# EAGLE design gimbaldriver (EAGLE 7.1.0)
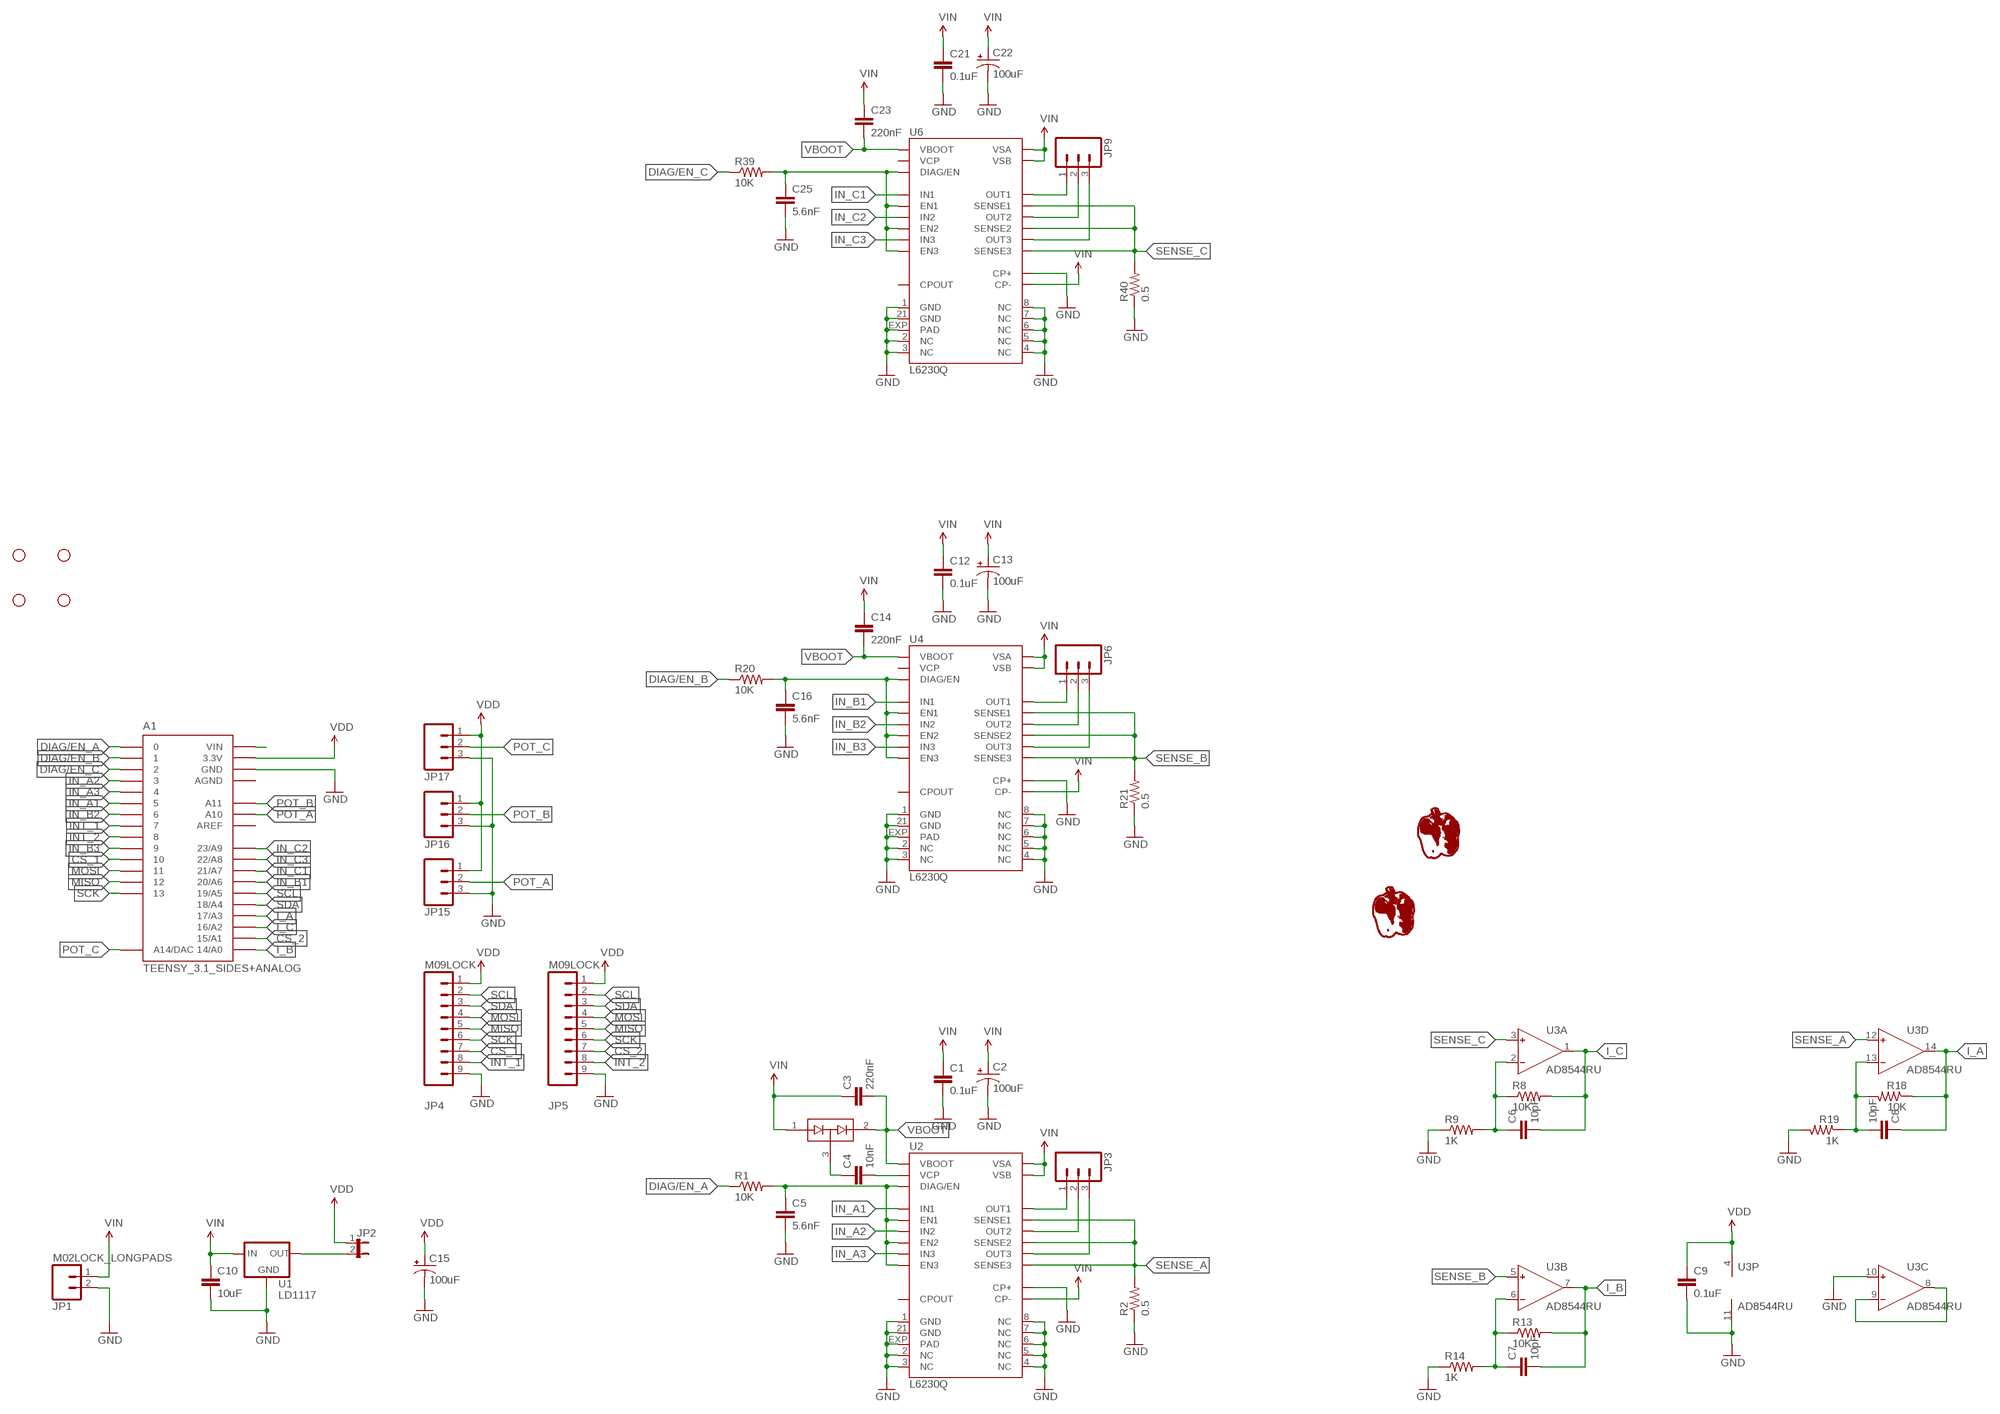
[diagram p0: schematic, sheet 1]

## Parts
A1  TEENSY_3.1_SIDES+ANALOG  [TEENSY_3.1_SIDES+ANALOG]
C1  0.1uF  CAP0603-CAP  [0603-CAP]
C2  100uF  CAP_POLPTH1  [CPOL-RADIAL-100UF-25V]
C3  220nF  CAP0603-CAP  [0603-CAP]
C4  10nF  CAP0603-CAP  [0603-CAP]
C5  5.6nF  CAP0603-CAP  [0603-CAP]
C6  10pF  CAP0603-CAP  [0603-CAP]
C7  10pF  CAP0603-CAP  [0603-CAP]
C8  10pF  CAP0603-CAP  [0603-CAP]
C9  0.1uF  CAP0603-CAP  [0603-CAP]
C10  10uF  CAP1206  [1206]
C12  0.1uF  CAP0603-CAP  [0603-CAP]
C13  100uF  CAP_POLPTH1  [CPOL-RADIAL-100UF-25V]
C14  220nF  CAP0603-CAP  [0603-CAP]
C15  100uF  CAP_POLPTH1  [CPOL-RADIAL-100UF-25V]
C16  5.6nF  CAP0603-CAP  [0603-CAP]
C21  0.1uF  CAP0603-CAP  [0603-CAP]
C22  100uF  CAP_POLPTH1  [CPOL-RADIAL-100UF-25V]
C23  220nF  CAP0603-CAP  [0603-CAP]
C25  5.6nF  CAP0603-CAP  [0603-CAP]
D1  BAV99  [SOT23]
JP1  M02LOCK_LONGPADS  [1X02_LOCK_LONGPADS]
JP2  JUMPER-2PTH_LOCK  [1X02_LOCK]
JP3  M03LOCK_LONGPADS  [1X03_LOCK_LONGPADS]
JP4  M09LOCK  [1X09_LOCK]
JP5  M09LOCK  [1X09_LOCK]
JP6  M03LOCK_LONGPADS  [1X03_LOCK_LONGPADS]
JP9  M03LOCK_LONGPADS  [1X03_LOCK_LONGPADS]
JP15  M03LOCK  [1X03_LOCK]
JP16  M03LOCK  [1X03_LOCK]
JP17  M03LOCK  [1X03_LOCK]
R1  10K  RESISTOR0603-RES  [0603-RES]
R2  0.5  RESISTOR1206  [1206]
R8  10K  RESISTOR0603-RES  [0603-RES]
R9  1K  RESISTOR0603-RES  [0603-RES]
R13  10K  RESISTOR0603-RES  [0603-RES]
R14  1K  RESISTOR0603-RES  [0603-RES]
R18  10K  RESISTOR0603-RES  [0603-RES]
R19  1K  RESISTOR0603-RES  [0603-RES]
R20  10K  RESISTOR0603-RES  [0603-RES]
R21  0.5  RESISTOR1206  [1206]
R39  10K  RESISTOR0603-RES  [0603-RES]
R40  0.5  RESISTOR1206  [1206]
STANDOFF1  STAND-OFF  [STAND-OFF]
STANDOFF2  STAND-OFF  [STAND-OFF]
STANDOFF3  STAND-OFF  [STAND-OFF]
STANDOFF4  STAND-OFF  [STAND-OFF]
U1  LD1117  [SOT-223]
U2  L6230Q  [VFQFPN-32]
U3  AD8544RU  [TSSOP14]
U4  L6230Q  [VFQFPN-32]
U6  L6230Q  [VFQFPN-32]
U$1  GIMP-PEPPER  [GIMP-PEPPER]
U$2  GIMBALV1  [GIMBALV1]

## Nets
CS_1: A1.10 JP4.7
CS_2: A1.15/A1 JP5.7
DIAG/EN_A: A1.0 R1.1
DIAG/EN_B: A1.1 R20.1
DIAG/EN_C: A1.2 R39.1
GND: A1.GND C1.2 C2.2(-) C5.2 C9.2 C10.2 C12.2 C13.2(-) C15.2(-) C16.2 C21.2 C22.2(-) C25.2 JP1.2 JP4.9 JP5.9 JP15.3 JP16.3 JP17.3 R2.1 R9.1 R14.1 R19.2 R21.1 R40.1 U1.1(GND) U2.1(GND) U2.2(NC) U2.3(NC) U2.4(NC) U2.5(NC) U2.6(NC) U2.7(NC) U2.8(NC) U2.21(GND) U2.30(CP+) U2.EXP(PAD) U3.10(C:IN+) U3.11(P:V-) U4.1(GND) U4.2(NC) U4.3(NC) U4.4(NC) U4.5(NC) U4.6(NC) U4.7(NC) U4.8(NC) U4.21(GND) U4.30(CP+) U4.EXP(PAD) U6.1(GND) U6.2(NC) U6.3(NC) U6.4(NC) U6.5(NC) U6.6(NC) U6.7(NC) U6.8(NC) U6.21(GND) U6.30(CP+) U6.EXP(PAD)
I_A: A1.17/A3 C8.1 R18.1 U3.14(D:OUT)
I_B: A1.14/A0 C7.2 R13.2 U3.7(B:OUT)
I_C: A1.16/A2 C6.2 R8.2 U3.1(A:OUT)
IN_A1: A1.5 U2.26(IN1)
IN_A2: A1.3 U2.13(IN2)
IN_A3: A1.4 U2.28(IN3)
IN_B1: A1.20/A6 U4.26(IN1)
IN_B2: A1.6 U4.13(IN2)
IN_B3: A1.9 U4.28(IN3)
IN_C1: A1.21/A7 U6.26(IN1)
IN_C2: A1.23/A9 U6.13(IN2)
IN_C3: A1.22/A8 U6.28(IN3)
INT_1: A1.7 JP4.8
INT_2: A1.8 JP5.8
MISO: A1.12 JP4.5 JP5.5
MOSI: A1.11 JP4.4 JP5.4
N$3: A1.VIN
N$6: C5.1 R1.2 U2.9(DIAG/EN) U2.14(EN2) U2.16(EN3) U2.27(EN1)
N$7: C6.1 R8.1 R9.2 U3.2(A:IN-)
N$8: JP3.1 U2.31(OUT1)
N$9: JP3.2 U2.23(OUT2)
N$10: JP3.3 U2.19(OUT3)
N$13: C7.1 R13.1 R14.2 U3.6(B:IN-)
N$19: C8.2 R18.2 R19.1 U3.13(D:IN-)
N$20: U3.8(C:OUT) U3.9(C:IN-)
N$25: C16.1 R20.2 U4.9(DIAG/EN) U4.14(EN2) U4.16(EN3) U4.27(EN1)
N$26: JP6.1 U4.31(OUT1)
N$27: JP6.2 U4.23(OUT2)
N$28: JP6.3 U4.19(OUT3)
N$32: C4.2 U2.24(VCP)
N$33: C25.1 R39.2 U6.9(DIAG/EN) U6.14(EN2) U6.16(EN3) U6.27(EN1)
N$34: C4.1 D1.3(COM)
N$46: JP9.1 U6.31(OUT1)
N$47: JP9.2 U6.23(OUT2)
N$48: JP9.3 U6.19(OUT3)
POT_A: A1.A10 JP15.2
POT_B: A1.A11 JP16.2
POT_C: A1.RST(A14/DAC) JP17.2
SCK: A1.13 JP4.6 JP5.6
SCL: A1.19/A5 JP4.2 JP5.2
SDA: A1.18/A4 JP4.3 JP5.3
SENSE_A: R2.2 U2.12(SENSE3) U2.25(SENSE2) U2.29(SENSE1) U3.12(D:IN+)
SENSE_B: R21.2 U3.5(B:IN+) U4.12(SENSE3) U4.25(SENSE2) U4.29(SENSE1)
SENSE_C: R40.2 U3.3(A:IN+) U6.12(SENSE3) U6.25(SENSE2) U6.29(SENSE1)
VBOOT: C3.2 C14.2 C23.2 D1.2(C2) U2.17(VBOOT) U4.17(VBOOT) U6.17(VBOOT)
VDD: A1.3.3V C9.1 C15.1(+) JP2.1 JP4.1 JP5.1 JP15.1 JP16.1 JP17.1 U3.4(P:V+)
VDDREG: JP2.2 U1.2(OUT) U1.4(OUT)
VIN: C1.1 C2.1(+) C3.1 C10.1 C12.1 C13.1(+) C14.1 C21.1 C22.1(+) C23.1 D1.1(A1) JP1.1 U1.3(IN) U2.15(CP-) U2.20(VSB) U2.22(VSA) U4.15(CP-) U4.20(VSB) U4.22(VSA) U6.15(CP-) U6.20(VSB) U6.22(VSA)
Unconnected: A1.AREF U2.11(CPOUT) U4.11(CPOUT) U4.24(VCP) U6.11(CPOUT) U6.24(VCP)

## Power pins joined to a net without a drawn wire
AGND: A1.AGND

## Library data of the parts
A1 = Teensy3.0:TEENSY_3.1_SIDES+ANALOG
C1 C3-C10 C12 C14 C16 C21 C23 C25 = SparkFun-Passives:CAP: Capacitor Standard 0603 ceramic capacitor, and 0.1" leaded capacitor.
C2 C13 C15 C22 = SparkFun-Passives:CAP_POL: Capacitor Polarized These are standard SMD and PTH capacitors. Normally 10uF, 47uF, and 100uF in electrolytic and tantalum varieties. Always verify the external diameter of the through hole cap, it varies with capacity, voltage, and manufacturer. The EIA devices should be standard.
D1 = SparkFun-DiscreteSemi:BAV99: Two small signal silicon diodes connected anode to cathode. Connections to all three nodes available. DIO-10647; PROD_ID: DIO-10647
JP1 = SparkFun-Connectors:M02: Standard 2-pin 0.1" header. Use with - straight break away headers ( PRT-00116) - right angle break away headers (PRT-00553) - swiss pins (PRT-00743) - machine pins (PRT-00117) - female headers (PRT-00115) Molex polarized connector foot print use with: PRT-08233 with associated crimp pins and housings. 2.54_SCREWTERM for use with PRT-10571. 3.5mm Screw Terminal footprints for PRT-08084 5mm Screw Terminal footprints for use with PRT-08432
JP2 = SparkFun-Retired:JUMPER-2: Jumper Basic 0.1" spaced jumper. Use with breakaway headers.
JP3 JP6 JP9 JP15-JP17 = SparkFun-Connectors:M03: Header 3 Standard 3-pin 0.1" header. Use with straight break away headers (SKU : PRT-00116), right angle break away headers (PRT-00553), swiss pins (PRT-00743), machine pins (PRT-00117), and female headers (PRT-00115). Molex polarized connector foot print use with SKU : PRT-08232 with associated crimp pins and housings.
JP4 JP5 = SparkFun-Connectors:M09: Header 9 Standard 9-pin 0.1" header. Use with straight break away headers (SKU : PRT-00116), right angle break away headers (PRT-00553), swiss pins (PRT-00743), machine pins (PRT-00117), and female headers (PRT-00115).
R1 R2 R8 R9 R13 R14 R18-R21 R39 R40 = SparkFun-Passives:RESISTOR: Resistor Basic schematic elements and footprints for 0603, 1206, and PTH resistors.
STANDOFF1-STANDOFF4 = SparkFun-Electromechanical:STAND-OFF: #4 Stand Off This is the mechanical footprint for a #4 phillips button head screw. Use the keepout ring to avoid running the screw head into surrounding components. SKU : PRT-00447
U1 = Custom:LD1117: Low-Dropout Voltage Regulator
U2 U4 U6 = Custom:L6230Q
U3 = analog-devices:AD8544: General-Purpose CMOS Rail-to-Rail Amplifiers Source: http://www.analog.com/static/imported-files/data_sheets/AD8541_8542_8544.pdf; MPN: AD8544ARUZ; OC_FARNELL: unknown; OC_NEWARK: 15P1001
U$1 = Custom:GIMP-PEPPER
U$2 = Custom:GIMBALV1

## Board
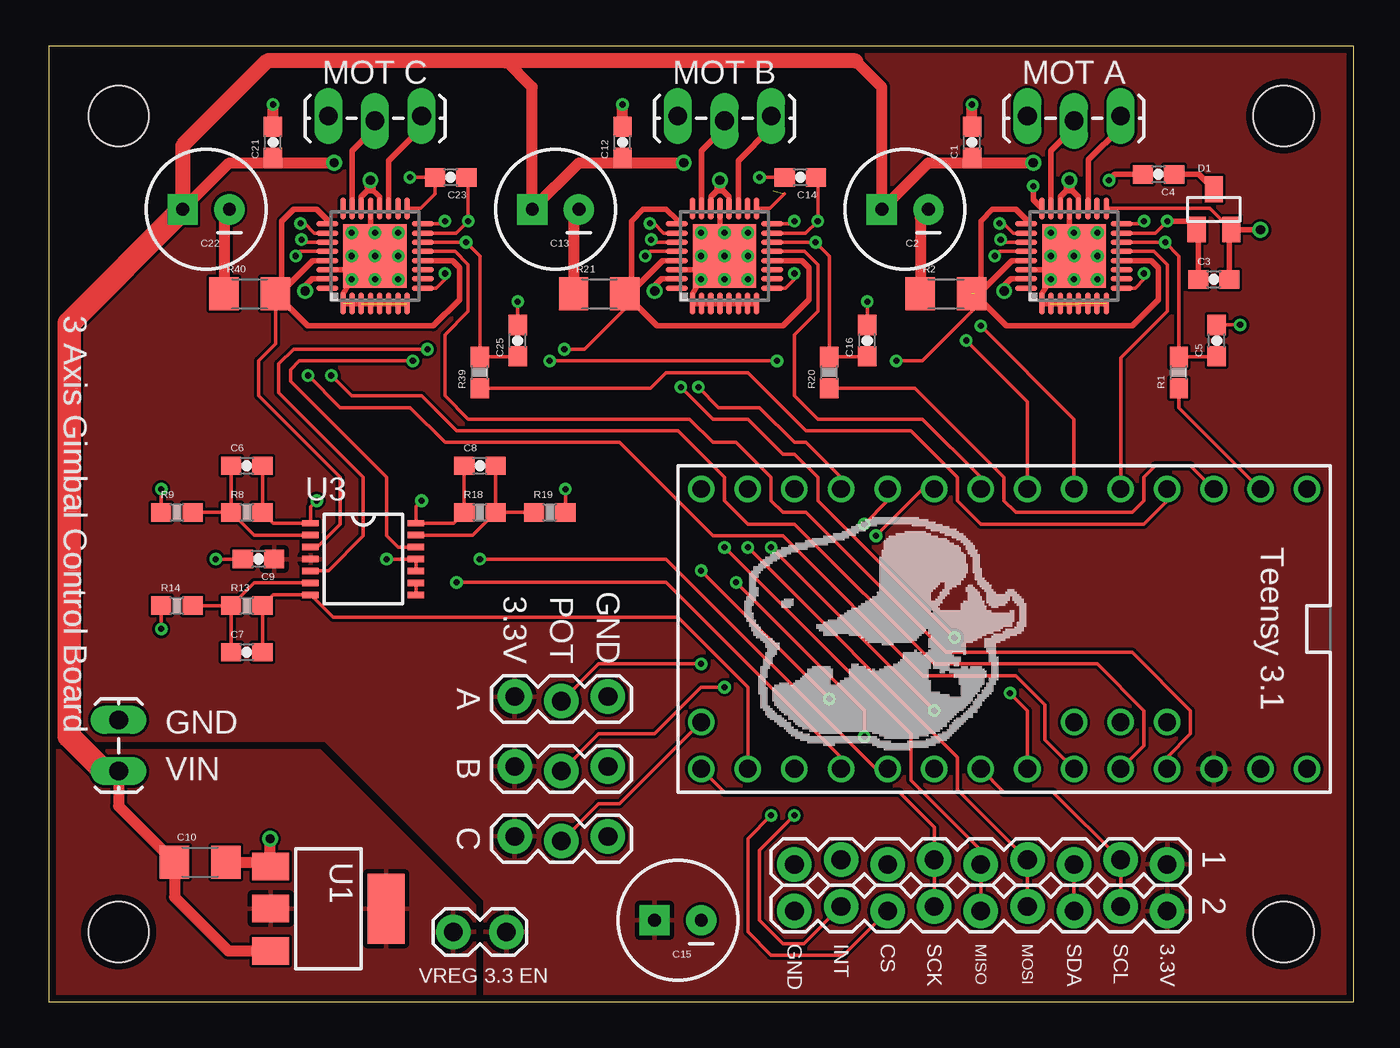
[diagram p1: board, top side]
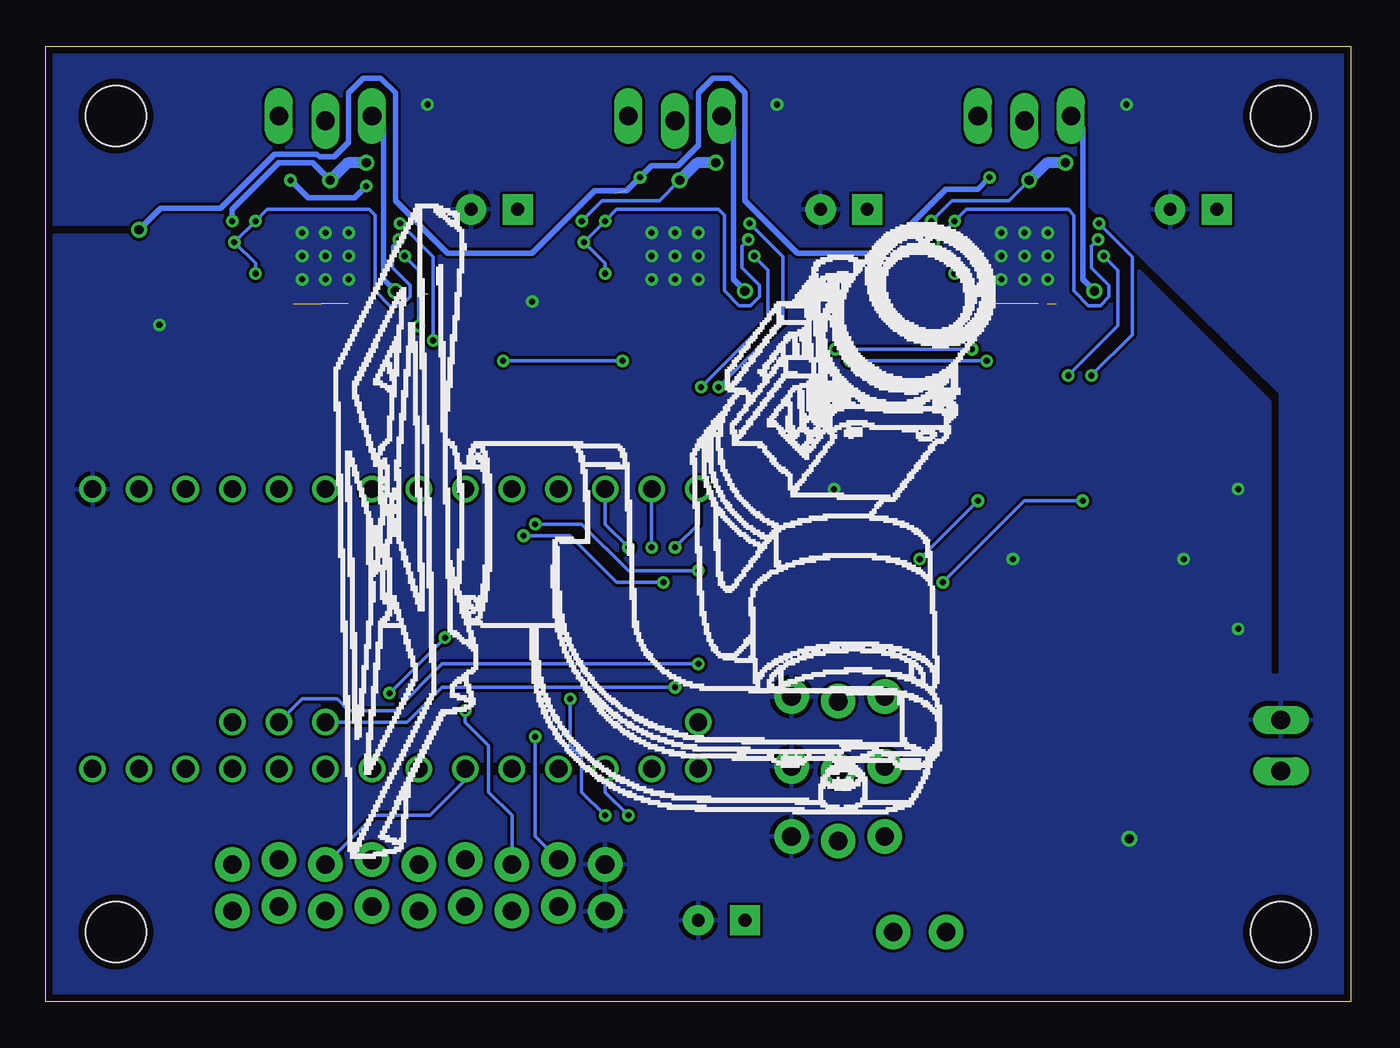
[diagram p2: board, bottom side, seen from below]

Size 71.12 x 52.07 mm. Coordinates in mm from the lower left corner, seen from the top.
Outline: 0,0 71.12,0 71.12,52.07 0,52.07 0,0
Copper layers (1*16): Top 0.0356mm / dielectric 1.5011mm / Bottom 0.0356mm
Design rules "LaenPCBOrder": minimum track width 6mil, minimum drill 13mil, track to track 6mil, track to pad 6mil, pad to pad 6mil, via to via 6mil, smd to smd 6mil, copper to edge 15mil, drill to drill 6mil, minimum pad ring 7mil, minimum via ring 7mil, stop-mask expansion 3mil, vias tented up to drill 0mil, thermal gap 10mil

### Footprints (pad centres in the part's own frame; a part is rotated, then mirrored left to right if it is on the bottom)
TEENSY_3.1_SIDES+ANALOG = drill 0.965: 0 -7.62,13.97; 1 -7.62,11.43; 2 -7.62,8.89; 3 -7.62,6.35; 3.3V 7.62,11.43; 4 -7.62,3.81; 5 -7.62,1.27; 6 -7.62,-1.27; 7 -7.62,-3.81; 8 -7.62,-6.35; 9 -7.62,-8.89; 10 -7.62,-11.43; 11 -7.62,-13.97; 12 -7.62,-16.51; 13 7.62,-16.51; 14/A0 7.62,-13.97; 15/A1 7.62,-11.43; 16/A2 7.62,-8.89; 17/A3 7.62,-6.35; 18/A4 7.62,-3.81; 19/A5 7.62,-1.27; 20/A6 7.62,1.27; 21/A7 7.62,3.81; 22/A8 7.62,6.35; 23/A9 7.62,8.89; A10 5.08,6.35; A11 5.08,3.81; AGND 7.62,13.97; AREF 5.08,8.89; GND -7.62,16.51; RST 5.08,-16.51; VIN 7.62,16.51
0603-CAP = smd 1.1 x 1: 1 -0.85,0; 2 0.85,0
CPOL-RADIAL-100UF-25V = drill 0.7 pad 1.651 square: 1 1.27,0 | drill 0.7 pad 1.651: 2 -1.27,0
1206 = smd 1.6 x 1.8: 1 -1.4,0; 2 1.4,0
SOT23 = smd 1 x 1.4: 1 -0.95,-1.1; 2 0.95,-1.1; 3 0,1.1
1X02_LOCK_LONGPADS = drill 1.016 long: 1 -0.127,0; 2 2.667,0
1X02_LOCK = drill 1.016 pad 1.88: 1 -0.178,0; 2 2.718,0
1X03_LOCK_LONGPADS = drill 1.016 long: 1 0,0; 2 2.54,-0.254; 3 5.08,0
1X09_LOCK = drill 1.016 pad 1.88: 1 0,0.127; 2 2.54,-0.127; 3 5.08,0.127; 4 7.62,-0.127; 5 10.16,0.127; 6 12.7,-0.127; 7 15.24,0.127; 8 17.78,-0.127; 9 20.32,0.127
1X03_LOCK = drill 1.016 pad 1.88: 1 0,0.127; 2 2.54,-0.127; 3 5.08,0.127
0603-RES = smd 1.1 x 1: 1 -0.85,0; 2 0.85,0
STAND-OFF = hole 3.302: 0,0
SOT-223 = smd 1.5 x 2: 1 -2.3,-3.15; 2 0,-3.15; 3 2.3,-3.15 | smd 3.8 x 2: 4 0,3.15
VFQFPN-32 = smd 1.2 x 0.3: 1 -2.6,1.75; 2 -2.6,1.25; 3 -2.6,0.75; 4 -2.6,0.25; 5 -2.6,-0.25; 6 -2.6,-0.75; 7 -2.6,-1.25; 8 -2.6,-1.75; 17 2.6,-1.75; 18 2.6,-1.25; 19 2.6,-0.75; 20 2.6,-0.25; 21 2.6,0.25; 22 2.6,0.75; 23 2.6,1.25; 24 2.6,1.75 | smd 0.3 x 1.2: 9 -1.75,-2.6; 10 -1.25,-2.6; 11 -0.75,-2.6; 12 -0.25,-2.6; 13 0.25,-2.6; 14 0.75,-2.6; 15 1.25,-2.6; 16 1.75,-2.6; 25 1.75,2.6; 26 1.25,2.6; 27 0.75,2.6; 28 0.25,2.6; 29 -0.25,2.6; 30 -0.75,2.6; 31 -1.25,2.6; 32 -1.75,2.6 | smd 3.45 x 3.45: EXP 0,0
TSSOP14 = smd 0.9 x 0.35: 1 -2.875,1.95; 2 -2.875,1.3; 3 -2.875,0.65; 4 -2.875,0; 5 -2.875,-0.65; 6 -2.875,-1.3; 7 -2.875,-1.95; 8 2.875,-1.95; 9 2.875,-1.3; 10 2.875,-0.65; 11 2.875,0; 12 2.875,0.65; 13 2.875,1.3; 14 2.875,1.95

### Placement (x,y rotation side)
A1  52.07,20.32 270 top
C1  50.32,46.83 90 top
C2  46.67,43.18 180 top
C3  63.5,39.37 0 top
C4  60.48,45.09 180 top
C5  63.66,36.04 90 top
C6  10.79,29.21 0 top
C7  10.79,19.05 0 top
C8  23.5,29.21 0 top
C9  11.43,24.13 180 top
C10  8.26,7.62 0 top
C12  31.27,46.83 90 top
C13  27.62,43.18 180 top
C14  40.96,44.93 180 top
C15  34.29,4.45 180 top
C16  44.61,36.04 90 top
C21  12.22,46.83 90 top
C22  8.57,43.18 180 top
C23  21.91,44.93 180 top
C25  25.56,36.04 90 top
D1  63.5,43.18 0 top
JP1  3.81,12.7 90 top
JP2  24.77,3.81 180 top
JP3  53.34,48.26 0 top
JP4  60.96,7.62 180 top
JP5  60.96,5.08 180 top
JP6  34.29,48.26 0 top
JP9  15.24,48.26 0 top
JP15  25.4,16.51 0 top
JP16  25.4,12.7 0 top
JP17  25.4,8.89 0 top
R1  61.59,34.29 90 top
R2  48.9,38.58 0 top
R8  10.79,26.67 0 top
R9  6.99,26.67 0 top
R13  10.79,21.59 0 top
R14  6.99,21.59 0 top
R18  23.5,26.67 0 top
R19  27.3,26.67 0 top
R20  42.55,34.29 90 top
R21  30,38.58 0 top
R39  23.5,34.29 90 top
R40  10.95,38.58 0 top
STANDOFF1  67.31,48.26 0 top
STANDOFF2  3.81,48.26 0 top
STANDOFF3  67.31,3.81 0 top
STANDOFF4  3.81,3.81 0 top
U1  15.24,5.08 270 top
U2  55.88,40.64 90 top
U3  17.14,24.13 0 top
U4  36.83,40.64 90 top
U6  17.78,40.64 90 top
U$1  45.09,20 270 top
U$2  36.83,25.4 90 bottom

### Tracks (layer width: path | path; a pad name or v marks a point on that pad's centre or on a via)
CS_1  (via drill 0.33)
  Top 0.203: v39.37,24.77 v48.26,15.88
  Bottom 0.203: A1.10 40.64,26.04 v39.37,24.77 | v48.26,15.88 48.26,15.24 46.99,13.97 46.99,11.43 45.72,10.16 JP4.7
CS_2  (via drill 0.33)
  Top 0.203: v39.37,10.16 38.1,8.89 38.1,3.81 39.37,2.54 43.31,2.54 JP5.7
  Bottom 0.203: A1.15/A1 40.64,11.43 v39.37,10.16
DIAG/EN_A
  Top 0.203: R1.1 61.59,32.38 A1.0
DIAG/EN_B
  Top 0.203: A1.1 62.23,29.21 60.33,29.21 59.69,28.57 59.69,27.3 59.05,26.67 52.7,26.67 52.07,27.3 52.07,28.57 47.2,33.44 R20.1
DIAG/EN_C
  Top 0.203: A1.2 60.96,27.3 59.69,26.04 50.8,26.04 49.53,27.3 49.53,28.57 46.99,31.11 41.27,31.11 38.1,34.29 33.66,34.29 32.8,33.44 R39.1
GND  (via drill 0.33, 0.51)  (12 unrouted)
  Top 0.203: C5.2 v64.93,36.89 | C16.2 v44.61,38.16 | C25.2 v25.56,38.16 | C9.2 v9.11,24.13 | v18.41,24.13 U3.11 U3.10 | R9.1 v6.13,27.94 | R14.1 v6.13,20.32 | R19.2 v28.16,27.94
  Top 0.305: U4.30 35.45,39.89 35.56,40.01 v35.56,39.37 35.08,38.58 U4.1 U4.2 U4.3 U4.4 U4.5 U4.6 U4.7 U4.8 | U4.21 36.58,42.16 v36.83,41.91 | 16.39,39.89 16.51,40.01 v16.51,39.37 | U6.8 U6.1 16.03,38.58 v16.51,39.37 | U6.21 17.53,42.16 v17.78,41.91 | 54.49,39.89 54.61,40.01 v54.61,39.37 | U2.8 U2.1 54.13,38.58 v54.61,39.37 | U2.21 55.63,42.16 v55.88,41.91 | U2.30 54.61,39.89 v54.61,39.37 | U6.30 16.51,39.89 v16.51,39.37
  Top 0.61: C21.2 v12.22,48.9 | C1.2 v50.32,48.9 | C12.2 v31.27,48.9 | C22.2 9.55,42.89 R40.1 | C13.2 28.6,42.89 R21.1 | C2.2 47.49,42.73 R2.1 | v12.06,8.89 12.06,7.41 U1.1 11.85,7.62 C10.2
  other vias: 35.56,41.91 38.1,41.91 36.83,40.64 35.56,40.64 38.1,40.64 38.1,39.37 36.83,39.37 16.51,41.91 19.05,41.91 16.51,40.64 19.05,40.64 19.05,39.37 17.78,39.37 17.78,40.64 54.61,41.91 57.15,41.91 54.61,40.64 57.15,40.64 57.15,39.37 55.88,39.37 55.88,40.64
  pour Bottom: 0,0 0,52.07 71.12,52.07 70.96,42.39 66.2,42.39 65.09,43.5 51.44,43.5 49.05,41.12 44.77,41.12 42.39,43.5 32.38,43.5 30,41.12 25.72,41.12 23.34,43.5 14.29,43.5 3.81,33.18 3.81,17.78 4.45,17.78 4.45,32.7 14.61,42.86 23.02,42.86 25.4,40.48 30.32,40.48 32.7,42.86 42.07,42.86 44.45,40.48 49.37,40.48 51.75,42.86 64.77,42.86 65.88,41.75 70.96,41.75 71.12,0
I_A  (via drill 0.33)
  Top 0.203: C8.1 R18.1 22.05,26.08 U3.14 20.02,27 v20.32,27.3 | A1.17/A3 45.09,12.7 33.66,24.13 v23.5,24.13
  Bottom 0.203: v20.32,27.3 v23.5,24.13
I_B
  Top 0.203: C7.2 R13.2 12.23,22.18 U3.7 15.49,20.95 34.29,20.95 38.1,17.14 A1.14/A0
I_C  (via drill 0.33)
  Top 0.203: C6.2 R8.2 12.23,26.08 U3.1 14.27,26.97 v14.61,27.3 | A1.16/A2 43.18,13.34 33.66,22.86 v22.23,22.86
  Bottom 0.203: v22.23,22.86 17.78,27.3 15.24,27.3 v14.61,27.3
IN_A1  (via drill 0.33)
  Top 0.203: v51.82,42.42 52.04,42.42 52.57,41.89 U2.26 | v50.01,36.04 53.34,32.7 A1.5
  Bottom 0.203: v50.01,36.04 50.01,40.61 v51.82,42.42
IN_A2
  Top 0.203: U2.13 60.23,40.89 60.96,40.16 60.96,37.62 58.42,35.08 A1.3
IN_A3  (via drill 0.33)
  Top 0.203: U2.28 51.81,40.89 v51.56,40.64 | v50.8,36.83 55.88,31.75 A1.4
  Bottom 0.203: v51.56,40.64 50.8,39.88 v50.8,36.83
IN_B1  (via drill 0.33)
  Top 0.203: v32.77,42.42 32.99,42.42 33.52,41.89 U4.26 | v34.45,33.5 36.2,31.75 38.1,31.75 40.01,29.84 40.64,29.84 41.91,28.57 41.91,27.3 v49.37,19.84 | A1.20/A6 53.34,15.88 v52.39,16.83
  Bottom 0.203: v32.77,42.42 30.96,40.61 30.96,36.99 v34.45,33.5 | v52.39,16.83 v49.37,19.84
IN_B2
  Top 0.203: U4.13 41.18,40.89 41.91,40.16 41.91,37.62 40.64,36.35 40.64,33.02 41.91,31.75 47.62,31.75 50.8,28.57 A1.6
IN_B3  (via drill 0.33)
  Top 0.203: U4.28 32.76,40.89 v32.51,40.64 | v35.4,33.5 36.51,32.38 38.73,32.38 40.64,30.48 41.27,30.48 43.18,28.57 A1.9
  Bottom 0.203: v32.51,40.64 31.75,39.88 31.75,37.15 v35.4,33.5
IN_C1  (via drill 0.33)
  Top 0.203: U6.26 14.47,41.89 13.94,42.42 v13.72,42.42 | v14.13,34.13 15.88,32.38 19.68,32.38 21.59,30.48 31.11,30.48 36.2,25.4 40.01,25.4 47.62,17.78 52.7,17.78 54.29,16.19 54.29,14.29 A1.21/A7
  Bottom 0.203: v13.72,42.42 11.91,40.61 11.91,36.35 v14.13,34.13
IN_C2
  Top 0.203: U6.13 22.13,40.89 22.86,40.16 22.86,37.62 21.59,36.35 21.59,33.02 22.86,31.75 34.92,31.75 36.2,30.48 37.47,30.48 39.37,28.57 39.37,27.3 40.01,26.67 41.27,26.67 48.9,19.05 59.05,19.05 62.23,15.88 62.23,14.61 60.96,13.34 A1.23/A9
IN_C3  (via drill 0.33)
  Top 0.203: U6.28 13.71,40.89 v13.46,40.64 | A1.22/A8 59.69,13.97 59.69,15.88 57.15,18.41 48.26,18.41 40.64,26.04 38.1,26.04 36.83,27.3 36.83,28.57 34.29,31.11 22.23,31.11 20.32,33.02 16.51,33.02 v15.4,34.13
  Bottom 0.203: v13.46,40.64 12.7,39.88 12.7,36.83 v15.4,34.13
INT_1  (via drill 0.33)
  Top 0.203: A1.7 47.62,27.94 v45.09,25.4 | v37.47,22.86 44.45,15.88 v44.45,14.45
  Bottom 0.203: v45.09,25.4 42.55,25.4 40.01,22.86 v37.47,22.86 | v44.45,14.45 44.45,9.02 JP4.8
INT_2  (via drill 0.33)
  Top 0.203: A1.8 45.72,27.3 v44.45,26.04 | v35.56,23.5 v42.55,16.51 | v40.64,10.16 38.73,8.26 38.73,4.45 40.01,3.17 41.15,3.17 JP5.8
  Bottom 0.203: v44.45,26.04 41.91,26.04 39.37,23.5 v35.56,23.5 | v42.55,16.51 42.55,13.97 41.91,13.34 41.91,11.43 v40.64,10.16
MISO  (via drill 0.33)
  Top 0.203: v36.83,24.77 46.99,14.61 46.99,12.06 50.8,8.26 JP4.5 JP5.5
  Bottom 0.203: A1.12 35.56,26.04 v36.83,24.77
MOSI  (via drill 0.33)
  Top 0.203: v38.1,24.77 49.53,13.34 49.53,11.56 JP4.4 JP5.4
  Bottom 0.203: A1.11 v38.1,24.77
N$6  (via drill 0.33)
  Top 0.203: U2.14 v60.84,41.39 61.59,40.64 R1.2 63.61,35.14 C5.1 | U2.27 52.02,41.39 v51.88,41.53 | U2.9 59.21,38.89 59.69,39.37 v59.69,39.69 | U2.16 59.53,42.39 v59.69,42.55
  Bottom 0.203: v51.88,41.53 52.23,41.18 52.23,40.01 51.28,39.05 51.28,38.42 51.75,37.94 52.39,37.94 53.18,38.73 53.18,42.86 53.5,43.18 59.05,43.18 v59.69,42.55 v60.84,41.39 59.69,40.23 v59.69,39.69
N$7
  Top 0.203: U3.2 11.19,25.43 R8.1 | C6.1 R8.1 | R9.2 R8.1
N$8  (via drill 0.51)
  Top 0.305: U2.31 52.45,39.39 52.07,39.01 v52.07,38.73
  Bottom 0.305: JP3.1 52.7,47.62 52.7,39.37 v52.07,38.73
N$9
  Top 0.305: U2.23 54.63,46.38 55.88,47.62 JP3.2
N$10
  Top 0.305: U2.19 56.67,43.28 56.67,45.88 58.42,47.62 JP3.3
N$13
  Top 0.203: U3.6 11.19,22.83 R13.1 | R14.2 R13.1 | R13.1 C7.1
N$19
  Top 0.203: C8.2 R18.2 | R18.2 R19.1 | U3.13 23.11,25.43 R18.2
N$20
  Top 0.203: U3.8 U3.9
N$25  (via drill 0.33)
  Top 0.203: U4.14 v41.8,41.39 42.55,40.64 R20.2 44.56,35.14 C16.1 | U4.27 32.97,41.39 v32.83,41.53 | U4.9 40.16,38.89 40.64,39.37 v40.64,39.69 | U4.16 40.48,42.39 v40.64,42.55
  Bottom 0.203: v32.83,41.53 33.18,41.18 33.18,40.01 32.23,39.05 32.23,38.42 32.7,37.94 33.34,37.94 34.13,38.73 34.13,42.86 34.45,43.18 40.01,43.18 v40.64,42.55 v41.8,41.39 40.64,40.23 v40.64,39.69
N$26  (via drill 0.51)
  Top 0.305: U4.31 33.4,39.39 33.02,39.01 v33.02,38.73
  Bottom 0.305: JP6.1 33.66,47.62 33.66,39.37 v33.02,38.73
N$27
  Top 0.305: JP6.2 36.83,47.62 35.58,46.38 U4.23
N$28
  Top 0.305: JP6.3 39.37,47.62 37.58,45.84 U4.19
N$32  (via drill 0.33)
  Top 0.305: C4.2 58.1,45.09 v57.78,44.77 | v53.66,44.45 53.66,43.71 U2.24
  Bottom 0.305: v57.78,44.77 56.83,43.81 54.29,43.81 v53.66,44.45
N$33  (via drill 0.33)  (1 unrouted)
  Top 0.203: U6.16 21.43,42.39 | U6.14 v22.75,41.39 23.5,40.64 R39.2 25.51,35.14 C25.1 | U6.27 13.92,41.39 v13.78,41.53 | U6.9 21.11,38.89 21.59,39.37 v21.59,39.69 | 21.43,42.39 v21.59,42.55
  Bottom 0.203: v13.78,41.53 14.13,41.18 14.13,40.01 13.18,39.05 13.18,38.42 13.65,37.94 14.29,37.94 15.08,38.73 15.08,42.86 15.4,43.18 20.95,43.18 v21.59,42.55 v22.75,41.39 21.59,40.23 v21.59,39.69
N$34
  Top 0.305: D1.3 62.7,45.09 C4.1
N$46  (via drill 0.51)
  Top 0.305: v13.97,38.73 13.97,39.01 14.35,39.39 U6.31
  Bottom 0.305: JP9.1 14.61,47.62 14.61,39.37 v13.97,38.73
N$47
  Top 0.305: U6.23 16.53,46.38 17.78,47.62 JP9.2
N$48
  Top 0.305: U6.19 18.53,45.84 20.32,47.62 JP9.3
POT_A  (via drill 0.33)
  Top 0.203: v35.56,18.41 29.97,18.41 JP15.2
  Bottom 0.203: A1.A10 57.15,16.51 55.24,16.51 54.61,15.88 52.07,15.88 49.53,18.41 v35.56,18.41
POT_B  (via drill 0.33)
  Top 0.203: v36.83,17.14 35.56,17.14 33.02,14.61 29.97,14.61 JP16.2
  Bottom 0.203: A1.A11 51.44,15.24 49.53,17.14 v36.83,17.14
POT_C
  Top 0.203: A1.RST 31.11,10.79 29.97,10.79 JP17.2
SCK
  Top 0.203: JP5.6 JP4.6 48.26,9.53 46.35,11.43 36.83,11.43 A1.13
SCL
  Top 0.203: A1.19/A5 52.07,11.43 54.74,11.43 JP4.2 JP5.2
SDA
  Top 0.203: JP4.3 JP5.3
  Bottom 0.203: A1.18/A4 48.26,12.06 50.16,10.16 53.21,10.16 JP4.3
SENSE_A  (via drill 0.33)  (1 unrouted)
  Top 0.203: 50.45,38.58 50.45,37.75 47.62,34.92 v46.2,34.92 | v39.69,34.92 v27.3,34.92 | v19.84,34.92 13.65,34.92 13.18,34.45 13.18,33.81 18.41,28.57 18.41,25.4 19.04,24.78 U3.12
  Top 0.305: U2.29 52.49,40.39 50.8,38.7 | U2.25 53.28,42.6 52.7,43.18 51.44,43.18 50.8,42.55 50.8,38.7 | U2.12 60.1,40.39 60.48,40.01 60.48,38.26 59.05,36.83 52.2,36.83 50.45,38.58 50.58,38.7 50.8,38.7
  Bottom 0.203: v46.2,34.92 v39.69,34.92 | v27.3,34.92 v19.84,34.92
SENSE_B  (via drill 0.33)
  Top 0.203: R21.2 31.4,37.75 29.21,35.56 v28.1,35.56 | v20.64,35.56 13.34,35.56 12.54,34.77 12.54,33.18 17.14,28.57 17.14,25.4 15.24,23.5 14.29,23.5 U3.5
  Top 0.305: U4.29 33.44,40.39 31.75,38.7 | U4.25 34.23,42.6 33.66,43.18 32.38,43.18 31.75,42.55 31.75,38.7 | U4.12 41.05,40.39 41.43,40.01 41.43,38.26 40.01,36.83 33.15,36.83 R21.2 31.53,38.7 31.75,38.7
  Bottom 0.203: v28.1,35.56 v20.64,35.56
SENSE_C
  Top 0.203: R40.2 12.35,35.85 11.43,34.92 11.43,33.02 15.88,28.57 15.88,26.04 14.62,24.78 U3.3
  Top 0.305: U6.29 14.39,40.39 12.7,38.7 | U6.25 15.18,42.6 14.61,43.18 13.34,43.18 12.7,42.55 12.7,38.7 | U6.12 22,40.39 22.38,40.01 22.38,38.26 20.95,36.83 14.1,36.83 R40.2 12.48,38.7 12.7,38.7
VBOOT  (via drill 0.33, 0.51)  (1 unrouted)
  Top 0.203: U2.17 63.29,43.24 D1.2 | U4.17 39.31,43.24 40.11,44.04 | U6.17 20.26,43.24 21.06,44.04 C23.2 v19.68,44.93 | C14.2 v38.73,44.93
  Top 0.305: C3.2 64.35,41.98 D1.2 v66.04,42.07
  Bottom 0.305: v66.04,42.07 64.87,43.24 61.59,43.24 58.64,46.2 56.36,46.2 56.2,46.04 55.4,46.04 54.61,46.83 54.61,49.53 53.82,50.32 52.86,50.32 52.07,49.53 52.07,43.66 49.21,40.8 44.61,40.8 41.21,44.2 39.47,44.2 v38.73,44.93 38.1,45.56 36.67,45.56 35.56,46.67 35.56,49.53 34.77,50.32 33.81,50.32 33.02,49.53 33.02,43.66 30.16,40.8 25.56,40.8 22.07,44.29 20.32,44.29 v19.68,44.93
VDD
  pour Top: 0,14.29 15.08,14.29 23.81,5.56 23.81,0 71.12,0 71.12,52.07 0,52.07
VDDREG
  pour Top: 0,0 23.18,0 23.18,5.24 14.76,13.65 0,13.65
VIN  (via drill 0.33, 0.51)
  Top 0.203: U4.15 41.26,41.89 v41.91,42.55 41.91,44.82 C14.1 | U2.15 60.3,41.89 v60.96,42.55 | 62.09,42.55 D1.1 | U6.15 22.2,41.89 v22.86,42.55 22.86,44.82 C23.1
  Top 0.305: U4.22 36.08,43.86 36.58,44.35 | U4.20 37.08,43.86 36.58,44.36 v36.58,44.77 | U2.22 55.13,43.86 55.63,44.35 | U2.20 56.13,43.86 55.63,44.36 v55.63,44.77 | v60.96,42.55 62.09,42.55 | U6.22 17.03,43.86 17.53,44.35 | U6.20 18.03,43.86 17.53,44.36 v17.53,44.77 | C3.1 62.65,41.98 D1.1
  Top 0.61: 36.58,44.35 v36.58,44.77 | 31.54,45.72 v34.61,45.72 | C12.1 31.54,45.72 | 55.63,44.35 v55.63,44.77 | 50.59,45.72 v53.66,45.72 | C1.1 50.59,45.72 | 17.53,44.35 v17.53,44.77 | 12.48,45.72 v15.56,45.72 | C21.1 12.48,45.72 | C22.1 9.84,45.72 12.48,45.72 | 31.54,45.72 28.89,45.72 C13.1 26.35,49.85 24.92,51.28 | 50.59,45.72 47.94,45.72 C2.1 45.4,49.85 43.97,51.28 | U1.3 9.79,2.78 6.86,5.71 C10.1 3.81,10.66 JP1.1
  Top 0.813: C22.1 7.3,46.67 11.91,51.28 24.92,51.28 43.97,51.28
  Top 1.27: C22.1 1.11,36.99 1.11,14.48 3.02,12.57 JP1.1
  Bottom 0.203: v36.58,44.77 37.69,43.66 40.8,43.66 v41.91,42.55 | v17.53,44.77 18.64,43.66 21.75,43.66 v22.86,42.55
  Bottom 0.305: v55.63,44.77 56.58,45.72 58.42,45.72 60.96,43.18 v60.96,42.55
  Bottom 0.61: v34.61,45.72 35.62,45.72 v36.58,44.77 | v53.66,45.72 54.67,45.72 v55.63,44.77 | v15.56,45.72 16.57,45.72 v17.53,44.77

### Text on the board
tPlace: MOT C | MOT B | MOT A | 3 Axis Gimbal Control Board | Teensy 3.1 | 3.3V | POT | GND | A | GND | VIN | B | C | 1 | 2 | GND | INT | CS | SCK | MISO | MOSI | SDA | SCL | 3.3V | VREG 3.3 EN